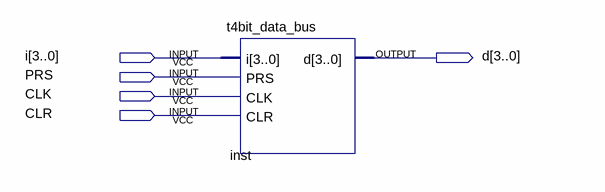
[diagram p0: schematic sheet]
// Quartus schematic test01.bdf as structural Verilog: 1 symbols, 5 pins
module test01 (
  input  [3:0] i,
  input  PRS,
  input  CLK,
  input  CLR,
  output [3:0] d
);

  t4bit_data_bus inst (.i(i), .PRS(PRS), .CLK(CLK), .CLR(CLR), .d(d));
endmodule
